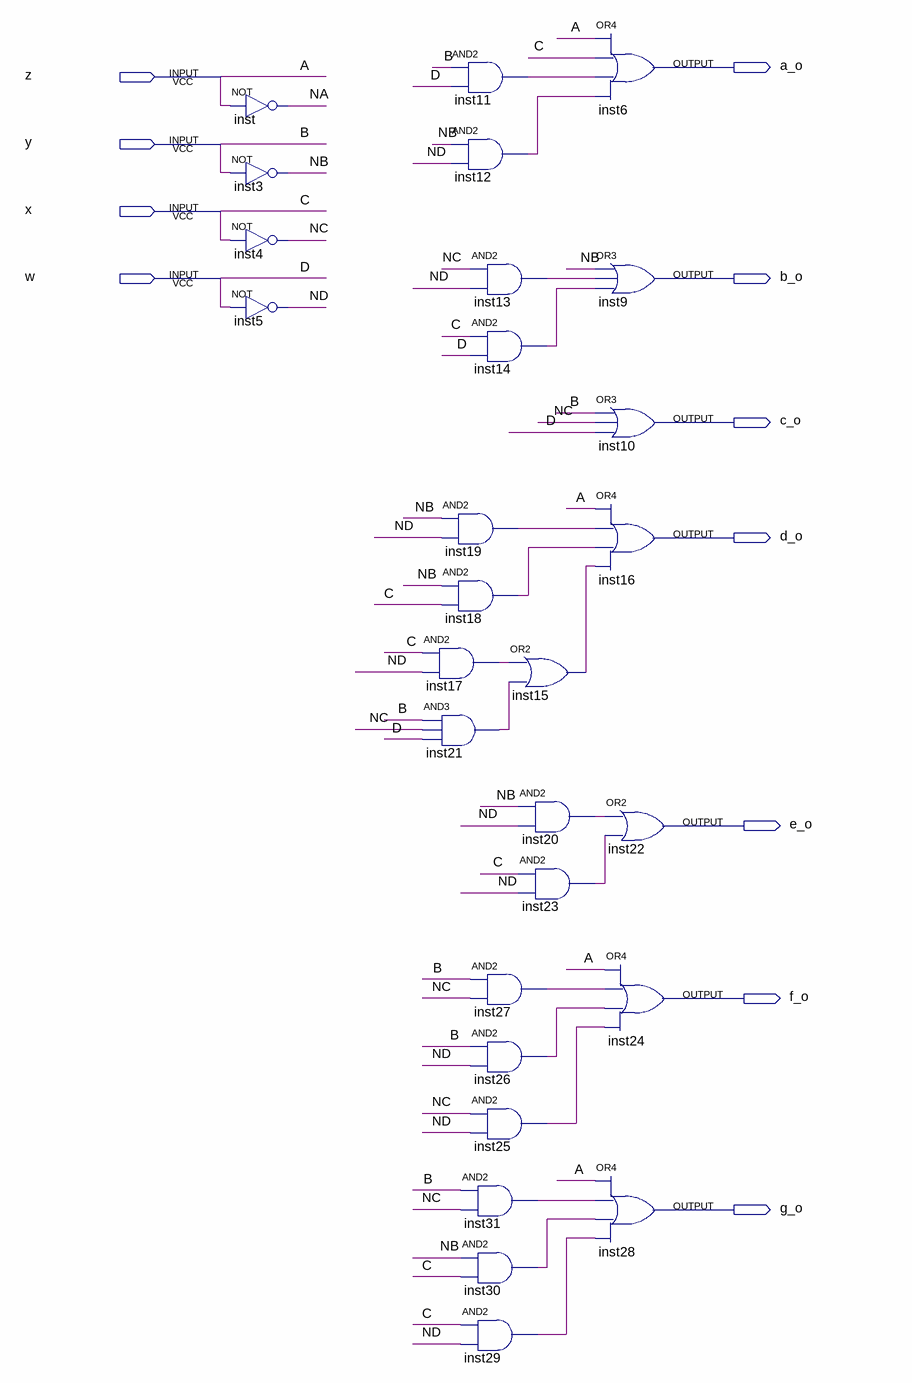
[diagram p0: schematic sheet]
// Quartus schematic bcd_box.bdf as structural Verilog: 28 symbols, 11 pins
module bcd_box (
  input  z,
  input  y,
  input  x,
  input  w,
  output a_o,
  output b_o,
  output c_o,
  output d_o,
  output e_o,
  output f_o,
  output g_o
);

  wire inst11_out, inst12_out, inst13_out, inst14_out, inst15_out, inst17_out, inst18_out, inst19_out,
       inst20_out, inst21_out, inst23_out, inst25_out, inst26_out, inst27_out, inst29_out, inst30_out,
       inst31_out, NA, NB, NC, ND;

  not inst (NA, z);
  not inst3 (NB, y);
  not inst4 (NC, x);
  not inst5 (ND, w);
  and inst11 (inst11_out, y, w);
  and inst12 (inst12_out, NB, ND);
  and inst13 (inst13_out, NC, ND);
  and inst14 (inst14_out, x, w);
  and inst19 (inst19_out, NB, ND);
  and inst18 (inst18_out, NB, x);
  and inst17 (inst17_out, x, ND);
  and inst21 (inst21_out, y, NC, w);
  and inst27 (inst27_out, y, NC);
  and inst26 (inst26_out, y, ND);
  and inst25 (inst25_out, NC, ND);
  and inst31 (inst31_out, y, NC);
  and inst30 (inst30_out, NB, x);
  and inst29 (inst29_out, x, ND);
  or inst15 (inst15_out, inst17_out, inst21_out);
  and inst20 (inst20_out, NB, ND);
  and inst23 (inst23_out, x, ND);
  or inst6 (a_o, z, x, inst11_out, inst12_out);
  or inst9 (b_o, NB, inst13_out, inst14_out);
  or inst10 (c_o, y, NC, w);
  or inst16 (d_o, z, inst19_out, inst18_out, inst15_out);
  or inst22 (e_o, inst20_out, inst23_out);
  or inst24 (f_o, z, inst27_out, inst26_out, inst25_out);
  or inst28 (g_o, z, inst31_out, inst30_out, inst29_out);

  // Other names for the same wires on the sheet: D = w; C = x; B = y; A = z
endmodule
